# Altium project Aq1B_Guppy.PrjPcb
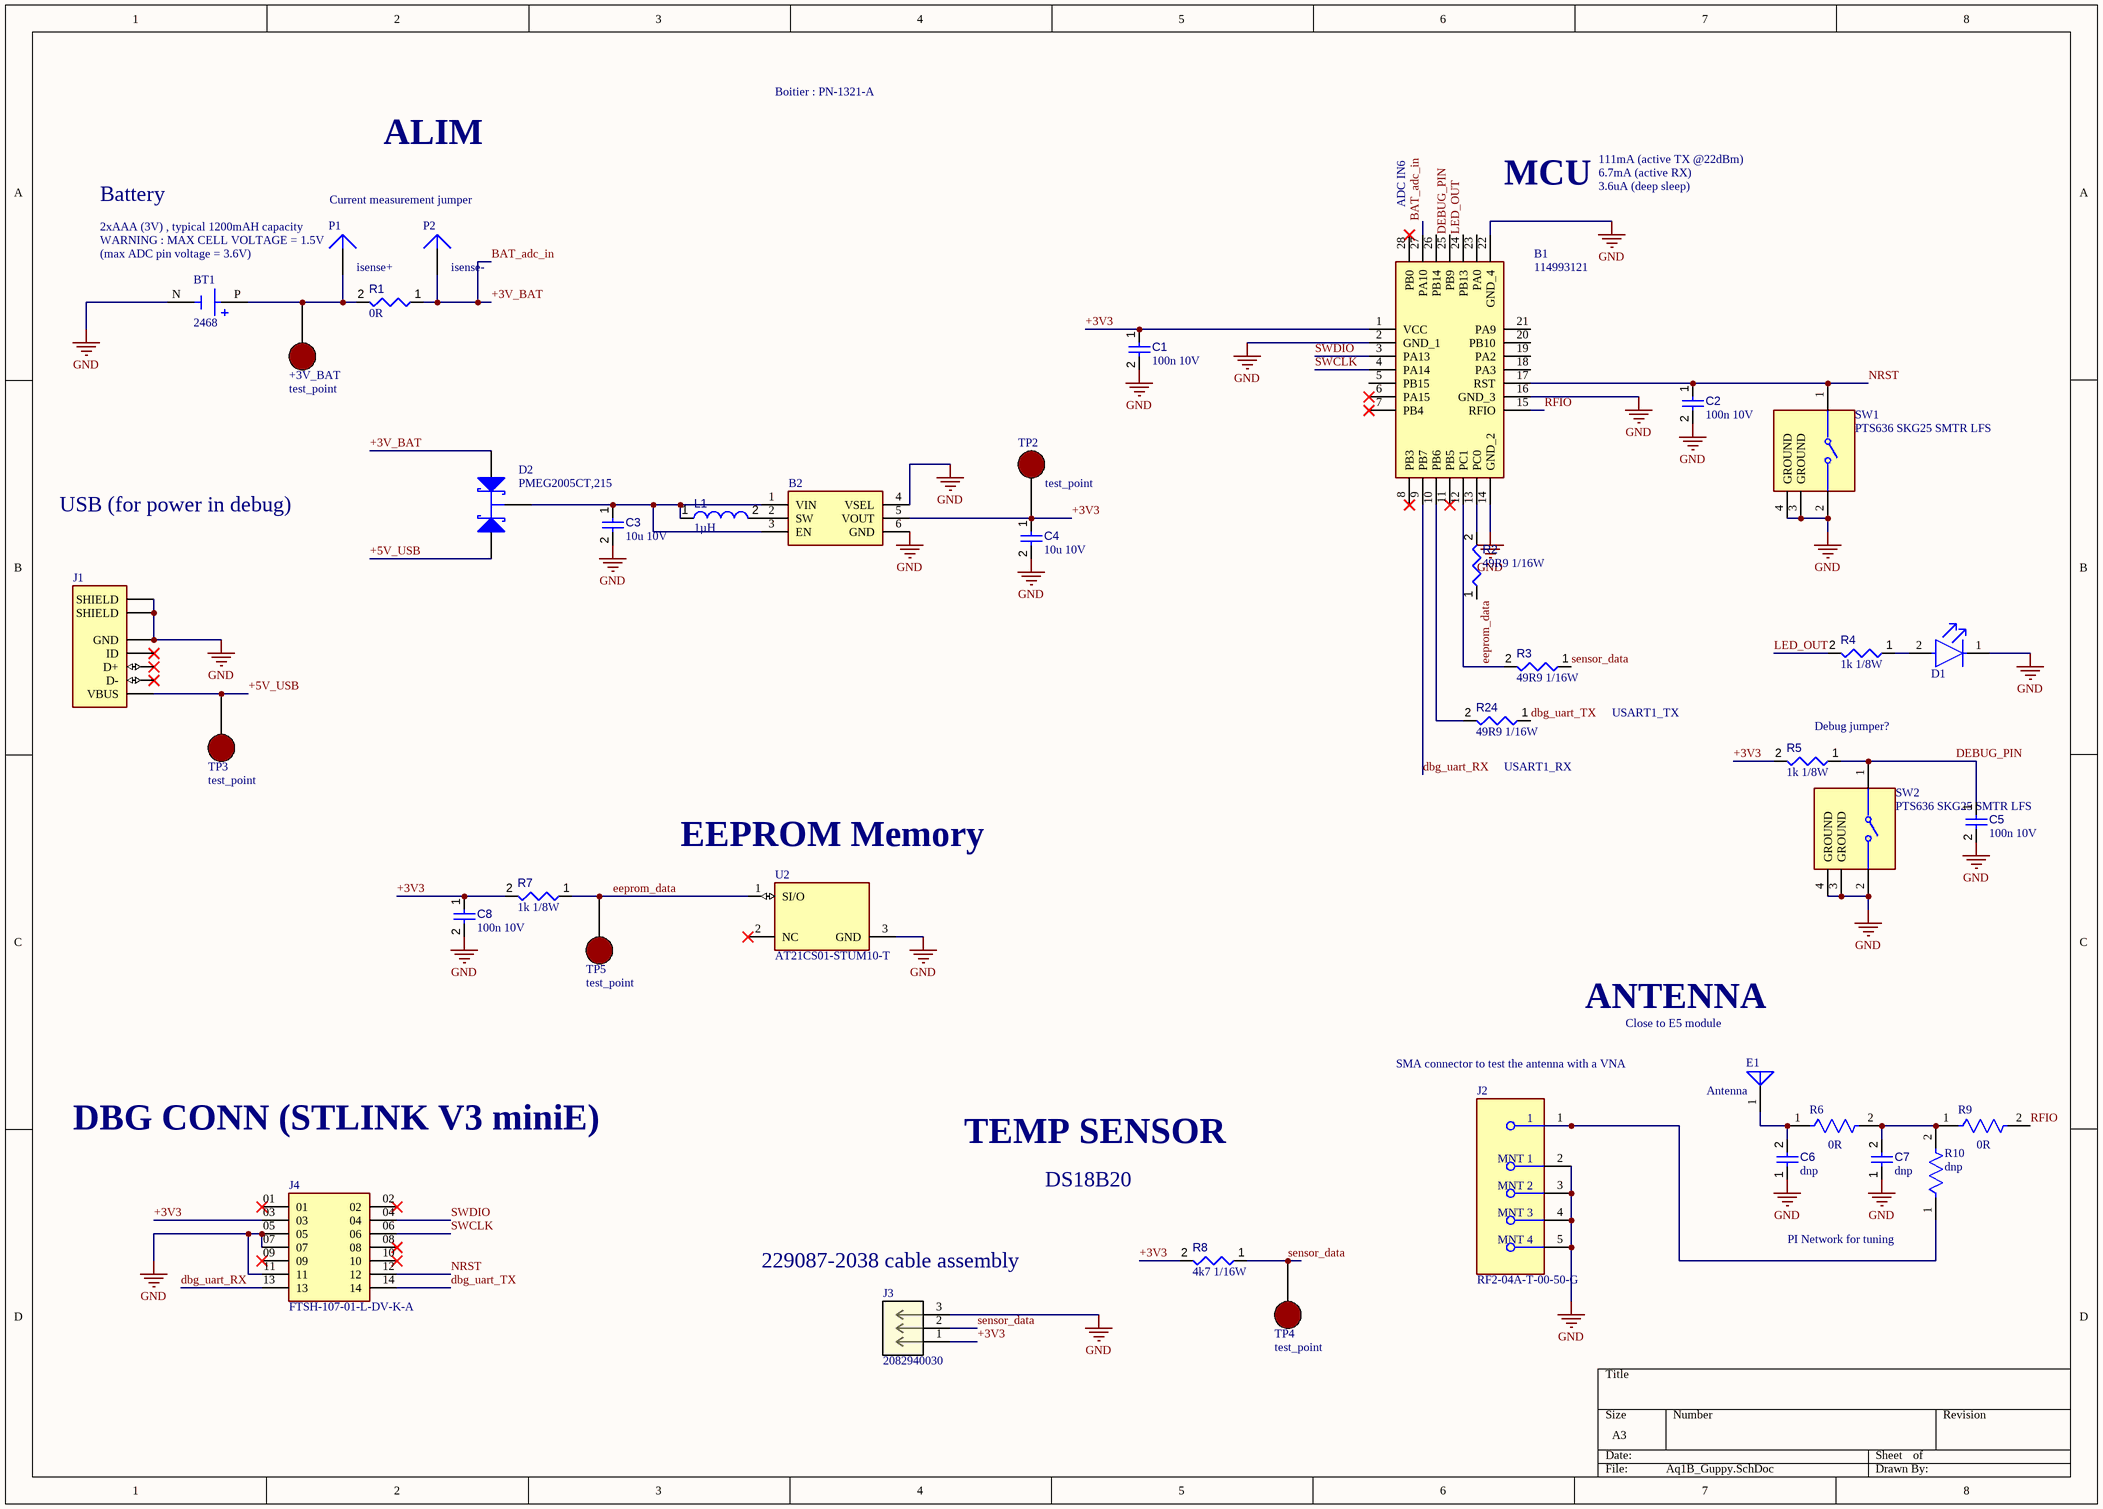
[diagram p0: Aq1B_Guppy.SchDoc]
1 sheet, 40 parts. Net scope: global (net labels, ports and power ports of the same name join across sheets).
Board file: Aq1B_Guppy.PcbDoc

## Sheet Aq1B_Guppy.SchDoc
size A3; SheetNumber: 1; SheetTotal: 1; SPICEModelCacheADGYIUXI: <root> / <DocumentId>ADGYIUXI</DocumentId> / </root>

### Parts
+3V_BAT  test_point  [test_point]
B1  114993121  [114993121]
B2  (no value)  [SOTFL50P160X60-6N]
BT1  2468  [BAT_2468]
C1  value 100n 10V  [CAPC0805(2012)145_L]  (hidden comment: Capacitor 4.7µF +/-40% 25V 0805)
C2  value 100n 10V  [CAPC0805(2012)145_L]  (hidden comment: Capacitor 4.7µF +/-40% 25V 0805)
C3  value 10u 10V  [CAPC0805(2012)145_L]  (hidden comment: Capacitor 4.7µF +/-40% 25V 0805)
C4  value 10u 10V  [CAPC0805(2012)145_L]  (hidden comment: Capacitor 4.7µF +/-40% 25V 0805)
C5  value 100n 10V  [CAPC0805(2012)145_L]  (hidden comment: Capacitor 4.7µF +/-40% 25V 0805)
C6  value dnp  [CAPC1608X90X40NL10T20]  (hidden comment: Capacitor 100 nF +/-10% 50 V 0603)
C7  value dnp  [CAPC1608X90X40NL10T20]  (hidden comment: Capacitor 100 nF +/-10% 50 V 0603)
C8  value 100n 10V  [CAPC0805(2012)145_L]  (hidden comment: Capacitor 4.7µF +/-40% 25V 0805)
D1  SML-D12V8WT86C  [FP-SML-D12-MFG]  (value not drawn)
D2  PMEG2005CT,215  [STM-BAT54CFILM-3_V]
E1  Antenna  [Antenna]
J1  (no value)  [GCT_USB3130-XX-X_REVD]
J2  RF2-04A-T-00-50-G  [FP-RF2-04A-T-00-50-G-MFG]
J3  2082940030  [CONN_2082940000-SD_03_MOL]
J4  FTSH-107-01-L-DV-K-A  [SAMTEC_FTSH-107-01-L-DV-K-A]
L1  value 1µH  [INDC2520X120X60NL20T20]  (hidden comment: WPN252010H1R0MT)
P1  isense+  [PIN1]
P2  isense-  [PIN1]
R1  value 0R  [RESC0805(2012)_L]
R2  value 49R9 1/16W  [RESC0805(2012)_L]
R3  value 49R9 1/16W  [RESC0805(2012)_L]
R4  value 1k 1/8W  [RESC0805(2012)_L]
R5  value 1k 1/8W  [RESC0805(2012)_L]
R6  0R  [FP-MCT0603-IPC_B]
R7  value 1k 1/8W  [RESC0805(2012)_L]
R8  value 4k7 1/16W  [RESC0805(2012)_L]
R9  0R  [FP-MCT0603-IPC_B]
R10  dnp  [FP-MCT0603-IPC_B]
R24  value 49R9 1/16W  [RESC0805(2012)_L]
SW1  PTS636 SKG25 SMTR LFS  [FP-PTS636_SKG25_SMTR_LFS-MFG]
SW2  PTS636 SKG25 SMTR LFS  [FP-PTS636_SKG25_SMTR_LFS-MFG]
TP2  test_point  [test_point]
TP3  test_point  [test_point]
TP4  test_point  [test_point]
TP5  test_point  [test_point]
U2  AT21CS01-STUM10-T  [FP-3TS1-IPC_C]

### Nets
GND: B1.2(GND_1) B1.14(GND_2) B1.16(GND_3) B1.22(GND_4) B2.4(VSEL) B2.6(GND) BT1.N(NEG) C1.2 C2.2 C3.2 C4.2 C5.2 C6.1 C7.1 C8.2 D1.1(C) J1.5(GND) J1.6(SHIELD) J1.7(SHIELD) J2.2(MNT_1) J2.3(MNT_2) J2.4(MNT_3) J2.5(MNT_4) J3.3 J4.05 J4.07 J4.11 SW1.2 SW1.3(GROUND) SW1.4(GROUND) SW2.2 SW2.3(GROUND) SW2.4(GROUND) U2.3(GND)
+3V3: B1.1(VCC) B2.5(VOUT) C1.1 C4.1 C8.1 J3.1 J4.03 R5.2 R7.2 R8.2 TP2.0
+3V_BAT: B1.27(PA10) D2.1(A) P2.1 R1.1  [also labelled BAT_adc_in]
+5V_USB: D2.2(A) J1.1(VBUS) TP3.0
dbg_uart_RX: B1.9(PB7) J4.13
dbg_uart_TX: J4.14 R24.1
DEBUG_PIN: B1.25(PB9) C5.1 R5.1 SW2.1
eeprom_data: R2.1 R7.1 TP5.0 U2.1(SI/O)
LED_OUT: B1.24(PB13) R4.2
NRST: B1.17(RST) C2.1 J4.12 SW1.1
RFIO: B1.15(RFIO) R9.2
sensor_data: J3.2 R3.1 R8.1 TP4.0
SWCLK: B1.4(PA14) J4.06
SWDIO: B1.3(PA13) J4.04
Net+3V_BAT_0: +3V_BAT.0 BT1.P(POS) P1.1 R1.2
NetB1_10: B1.10(PB6) R24.2
NetB1_12: B1.12(PC1) R3.2
NetB1_13: B1.13(PC0) R2.2
NetB2_1: B2.1(VIN) B2.3(EN) C3.1 D2.3(K) L1.1
NetB2_2: B2.2(SW) L1.2
NetC6_2: C6.2 E1.1(A) R6.1
NetC7_2: C7.2 R6.2 R9.1 R10.2
NetD1_2: D1.2(A) R4.1
NetJ2_1: J2.1 R10.1

Not connected (* = marked no-connect by the designer): B1 5(PB15) 6(PA15)* 7(PB4)* 8(PB3)* 11(PB5)* 18(PA3) 19(PA2) 20(PB10) 21(PA9) 23(PA0) 26(PB14) 28(PB0)*; J1 2(D-)* 3(D+)* 4(ID)*; J4 01* 02* 08* 09* 10*; U2 2(NC)*

### Notes on the sheet
- Boitier : PN-1321-A
- ALIM
- 111mA (active TX @22dBm)
- 6.7mA (active RX)
- Battery
- (near P1) 2xAAA (3V) , typical 1200mAH capacity
- WARNING : MAX CELL VOLTAGE = 1.5V
- Current measurement jumper
- ADC IN6
- MCU
- 3.6uA (deep sleep)
- (near BT1) (max ADC pin voltage = 3.6V)
- USB (for power in debug)
- USART1_TX
- (near R24) USART1_RX
- (near R5) Debug jumper?
- (near U2) EEPROM Memory
- ANTENNA
- Close to E5 module
- SMA connector to test the antenna with a VNA
- DBG CONN (STLINK V3 miniE)
- TEMP SENSOR
- DS18B20
- PI Network for tuning
- (near J3) 229087-2038 cable assembly

### Library data of the parts
B1 = 114993121: General ISM < 1GHz LoRaWAN Transceiver Module 868MHz, 915MHz Antenna Not Included Surface Mount; Manufacturer_Name: Seeed Studio; Geometry.Height: 2.7mm; Mouser Part Number: 713-114993121; Mouser Price/Stock: https://www.mouser.co.uk/ProductDetail/Seeed-Studio/114993121?qs=QpmGXVUTftF1SD6oRXq2Mw%3D%3D; Manufacturer_Part_Number: 114993121; Datasheet Link: https://files.seeedstudio.com/products/114993120/Wio-E5-LE%20module%20datasheet_v1.0.pdf
B2 = TPS61299DRLR: Switching Voltage Regulators 95nA quiescent current, 5.5V boost converter with input current limit and fast transient performance; Manufacturer_Name: Texas Instruments; Geometry.Height: 0.6mm; Mouser Part Number: 595-TPS61299DRLR; Mouser Price/Stock: https://www.mouser.co.uk/ProductDetail/Texas-Instruments/TPS61299DRLR?qs=IKkN%2F947nfBTwsVxPXoKBw%3D%3D; Manufacturer_Part_Number: TPS61299DRLR; Datasheet Link: https://www.ti.com/lit/ds/symlink/tps61299.pdf?ts=1731385304163
BT1 = 2468: Battery Holder, THM, 2 Cell, Cell Size AAA, Plastic | Keystone Electronics 2468; SnapEDA_Link: https://www.snapeda.com/parts/2468/Keystone/view-part/?ref=snap; Package: None; Value: *; MF: Keystone Electronics; MP: 2468; Check_prices: https://www.snapeda.com/parts/2468/Keystone/view-part/?ref=eda
C1-C5 C8 = CMP-001-00080-4: Chip Capacitor, 4.7µF +/-40%, 25V, 0805, Thickness 1.45 mm; Tolerance: 20%; Voltage Rating: 25V; Min Operating Temperature: -55°C; Max Operating Temperature: 85°C; Pins: 2; Mounting Technology: SMT; Case/Package: 0805
C6 C7 = CMP-001-00017-6: Chip Capacitor, 100 nF, +/- 10%, 50 V, 0603 (1608 Metric); Voltage Rating: 50V; Capacitor Type: Ceramic; Tolerance: 10%; Mounting Technology: SM; Max Operating Temperature: 125°C; RoHS Compliant: True; Pins: 2; Case/Package: 0603; Min Operating Temperature: -55°C
D1 = CMP-08952-000027-1: LED RED 1608 SMD; Forward Voltage: 2.2V; Luminous Intensity: 40mcd; Lens Size: 0.8mm; Lens Style: Flat; Lens Color: White; Test Current: 20mA; Dominant Wavelength: 630nm; Height: 0.65mm; Length: 1.6mm; Case Code (Metric): 1608; Color: Red; Mount: Surface Mount; Width: 0.8mm; Case Code (Imperial): 0603; Case/Package: 0603; Packaging: Tape and Reel
D2 = CMP-2000-05362-1: Small Signal Schottky Diode, 40 V, -40 to 150 degC, 3-Pin SOT23, RoHS, Tape and Reel; Manufacturer: STMicroelectronics; Forward Surge Current Ifsm Max: 1A; No. of Pins: 3Pins; Repetitive Reverse Voltage Vrrm Max: 30V; Product Range: BAT54Series; SVHC: NoSVHC(17-Dec-2015); Forward Voltage VF Max: 900mV; Diode Configuration: DualCommonCathode; Forward Current If(AV): 300mA; Diode Case Style: SOT-23; Package Reference: BAT54CFILM-3; Operating Temperature Max: 150degC; Datasheet Version: Rev. 11, 02/2015; Package Description: 3-Pin Small OutLine Transistor, Body 2.895 x 1.475 mm, Height 1.4 mm; Packaging: CutTape; Datasheet URL: http://www2.st.com/content/ccc/resource/technical/document/datasheet/07/50/54/f2/0d/ba/4a/79/CD00001322.pdf/files/CD00001322.pdf/jcr:content/translations/en.CD00001322.pdf; Manufacturer URL: http://www.st.com/; Automotive Qualification Standard: -; Package URL: http://www2.st.com/content/ccc/resource/technical/document/datasheet/07/50/54/f2/0d/ba/4a/79/CD00001322.pdf/files/CD00001322.pdf/jcr:content/translations/en.CD00001322.pdf
E1 = Antenna: Generic Antenna; Published: 24-Mar-1999; LatestRevisionDate: 17-Jul-2002; LatestRevisionNote: Re-released for DXP Platform.; PackageReference: PIN1; Publisher: Altium Limited
J1 = USB3130-XX-X_REVD: USB - micro B USB 2.0 Receptacle Connector 5 Position Through Hole; MP: USB3130-30-A; MF: Global Connector Technology; Availability: In Stock; Package: None; SnapEDA_Link: https://www.snapeda.com/parts/USB3130-30-A/Global+Connector+Technology/view-part/?ref=snap; Price: None; Value: *; Check_prices: https://www.snapeda.com/parts/USB3130-30-A/Global+Connector+Technology/view-part/?ref=eda
J2 = CMP-42753-000002-1: CONN SMA JACK STR 50 OHM PCB
J3 = 2082940030: Pico-EZmate HC PCB Header, 1.80mm Pitch, Single Row, Gold (Au) Plating, 3 Circuits; Manufacturer_Name: Molex Connector Corporation; Copyright: Copyright (C) 2025 Ultra Librarian. All rights reserved.; Manufacturer_Part_Number: 2082940030; RefDes: RefDes; Type: Type
J4 = FTSH-107-01-L-DV-K-A: Connector Header Surface Mount 14 position 0.050 (1.27mm); MF: Samtec Inc.; SnapEDA_Link: https://www.snapeda.com/parts/FTSH-107-01-L-DV-K-A/Samtec+Inc./view-part/?ref=snap; Package: None; Value: *; MP: FTSH-107-01-L-DV-K-A; Check_prices: https://www.snapeda.com/parts/FTSH-107-01-L-DV-K-A/Samtec+Inc./view-part/?ref=eda
L1 = CMP-006-00008-6: Chip Inductor, 1 uH, +/- 20%, 1 MHz, -55 to 125 degC, 1008 (2520 Metric), RoHS, Tape and Reel; Manufacturer: Murata; Self Resonant Frequency: 70MHz; Current Rating: 1.5A; Shielding: Shielded; Core Material: Ferrite; Resistance: 0.09Ohm; Datasheet URL: http://psearch.en.murata.com/inductor/product/LQM2HPN1R0MJ0%23.pdf; Datasheet Version: Aug-16; RoHS Compliant: True; Case/Package: 1008; Package Description: 2-Pin Surface Mount Device, Body 2.5 x 2 mm; Package Quantity: 3000; Tolerance: 20%; Min Operating Temperature: -40°C; Package Reference: 1008; Packaging: TapeandReel; Mounting Technology: SM; Max Operating Temperature: 85°C
P1 P2 = Plug: LatestRevisionDate: 17-Jul-2002; LatestRevisionNote: Re-released for DXP Platform.; Publisher: Altium Limited
R1-R5 R7 R8 R24 = CMP-009-00122-3: Chip Resistor, 470 Ohms, +/-5%, 125 mW, -55 to 155 degC, 0805; Tolerance: 5%; Power: 125mW; Max Operating Temperature: 155°C; Case/Package: 0805; Pins: 2; Min Operating Temperature: -55°C
R6 R9 R10 = CMP-02407-000658-1: RES SMD 100 OHM 1% 1/8W 0603; Resistance: 4.99kR; Tolerance: 0.5%; Temperature Coefficient: 25ppm/°C; Power Rating: 125mW; Voltage Rating: 75V; Contact Plating: Tin; Termination: SMD/SMT; Case/Package: 0603; Weight: 7.1E-05oz; Package Quantity: 5000; Mount: Surface Mount; Min Operating Temperature: -55°C; Width: 0.85mm; Case Code (Imperial): 0603; Composition: Thin Film; Case Code (Metric): 1608; Packaging: Tape and Reel; Max Operating Temperature: 175°C; Height: 0.45mm; Length: 1.55mm
SW1 SW2 = CMP-10040-000025-1: TACT 6.0 X 3.5, 2.5 MM H, 250GF,
U2 = CMP-06313-000022-1: IC EEPROM 1K I2C 125KHZ SOT23; Manufacturer: Microchip; Interface: I2C,Other; Nominal Supply Current: 0.08-0.2mA; Standoff Height: 0.01mm; Min Supply Voltage: 1.7V; Max Supply Voltage: 3.6V; Memory Size: 1Kbits; Device Class L3: EEPROM; Lead Free: Yes; Height: 1.12mm; Octopart: https://octopart.com/at21cs01-stum10-t-microchip-77757908; Temperature Range Low: -40°C; Manufacturer Part Number: AT21CS01-STUM10-T; Automotive: No; RoHS: TRUE; ComponentLink2URL: http://ww1.microchip.com/downloads/en/DeviceDoc/20005857C.pdf; Ipc Land Pattern Name: SOT95P237X100-3; Package: 3TS1; Frequency: 125kHz; Temperature Range High: +85°C; Device Class L1: Integrated Circuits (ICs); Category: IC; Digikey Description: IC EEPROM 1K I2C 125KHZ SOT23; ComponentLink2Description: Datasheet; Device Class L2: Memory; Temperature: -40°C to +85°C